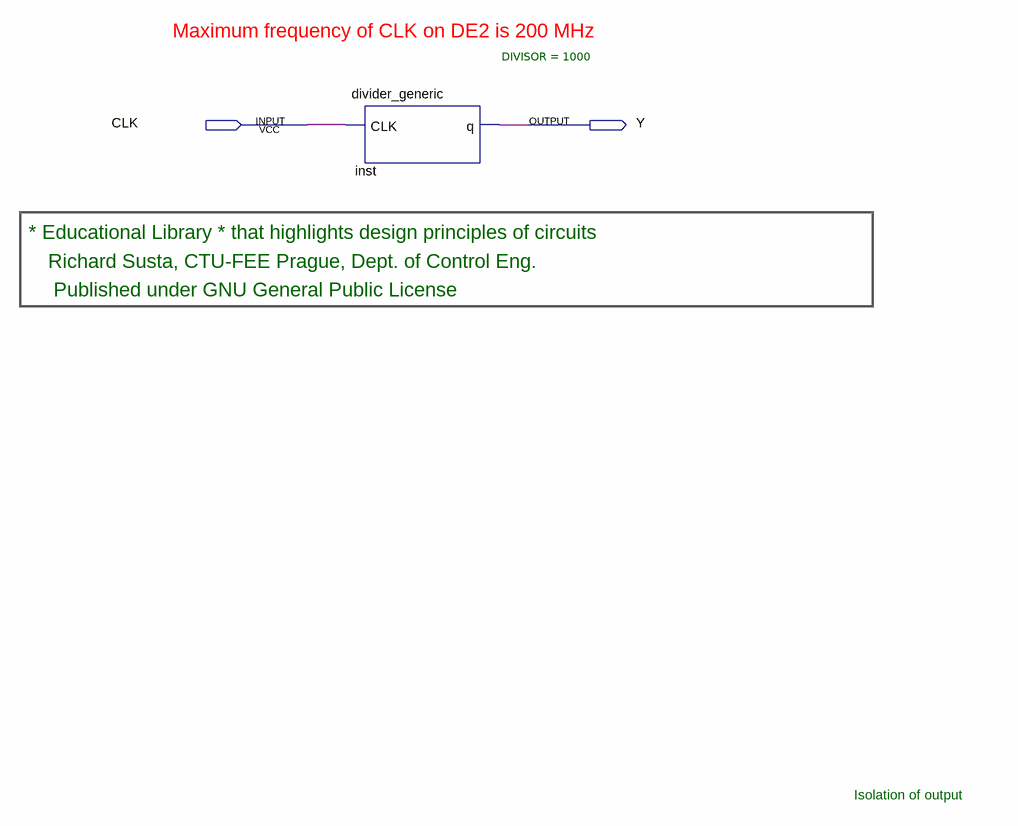
[diagram p0: schematic sheet]
// Quartus schematic divider1000.bdf as structural Verilog: 1 symbols, 2 pins
module divider1000 (
  input  CLK,
  output Y
);

  divider_generic #(.DIVISOR(1000)) inst (.CLK(CLK), .q(Y));

  // Notes on the sheet:
  //   Maximum frequency of CLK on DE2 is 200 MHz
  //   * Educational Library * that highlights design principles of circuits
  //   Richard Susta, CTU-FEE Prague, Dept. of Control Eng. 
  //    Published under GNU General Public License
  //   Isolation of output
endmodule
